# EAGLE design introAu (EAGLE 7.3.0)
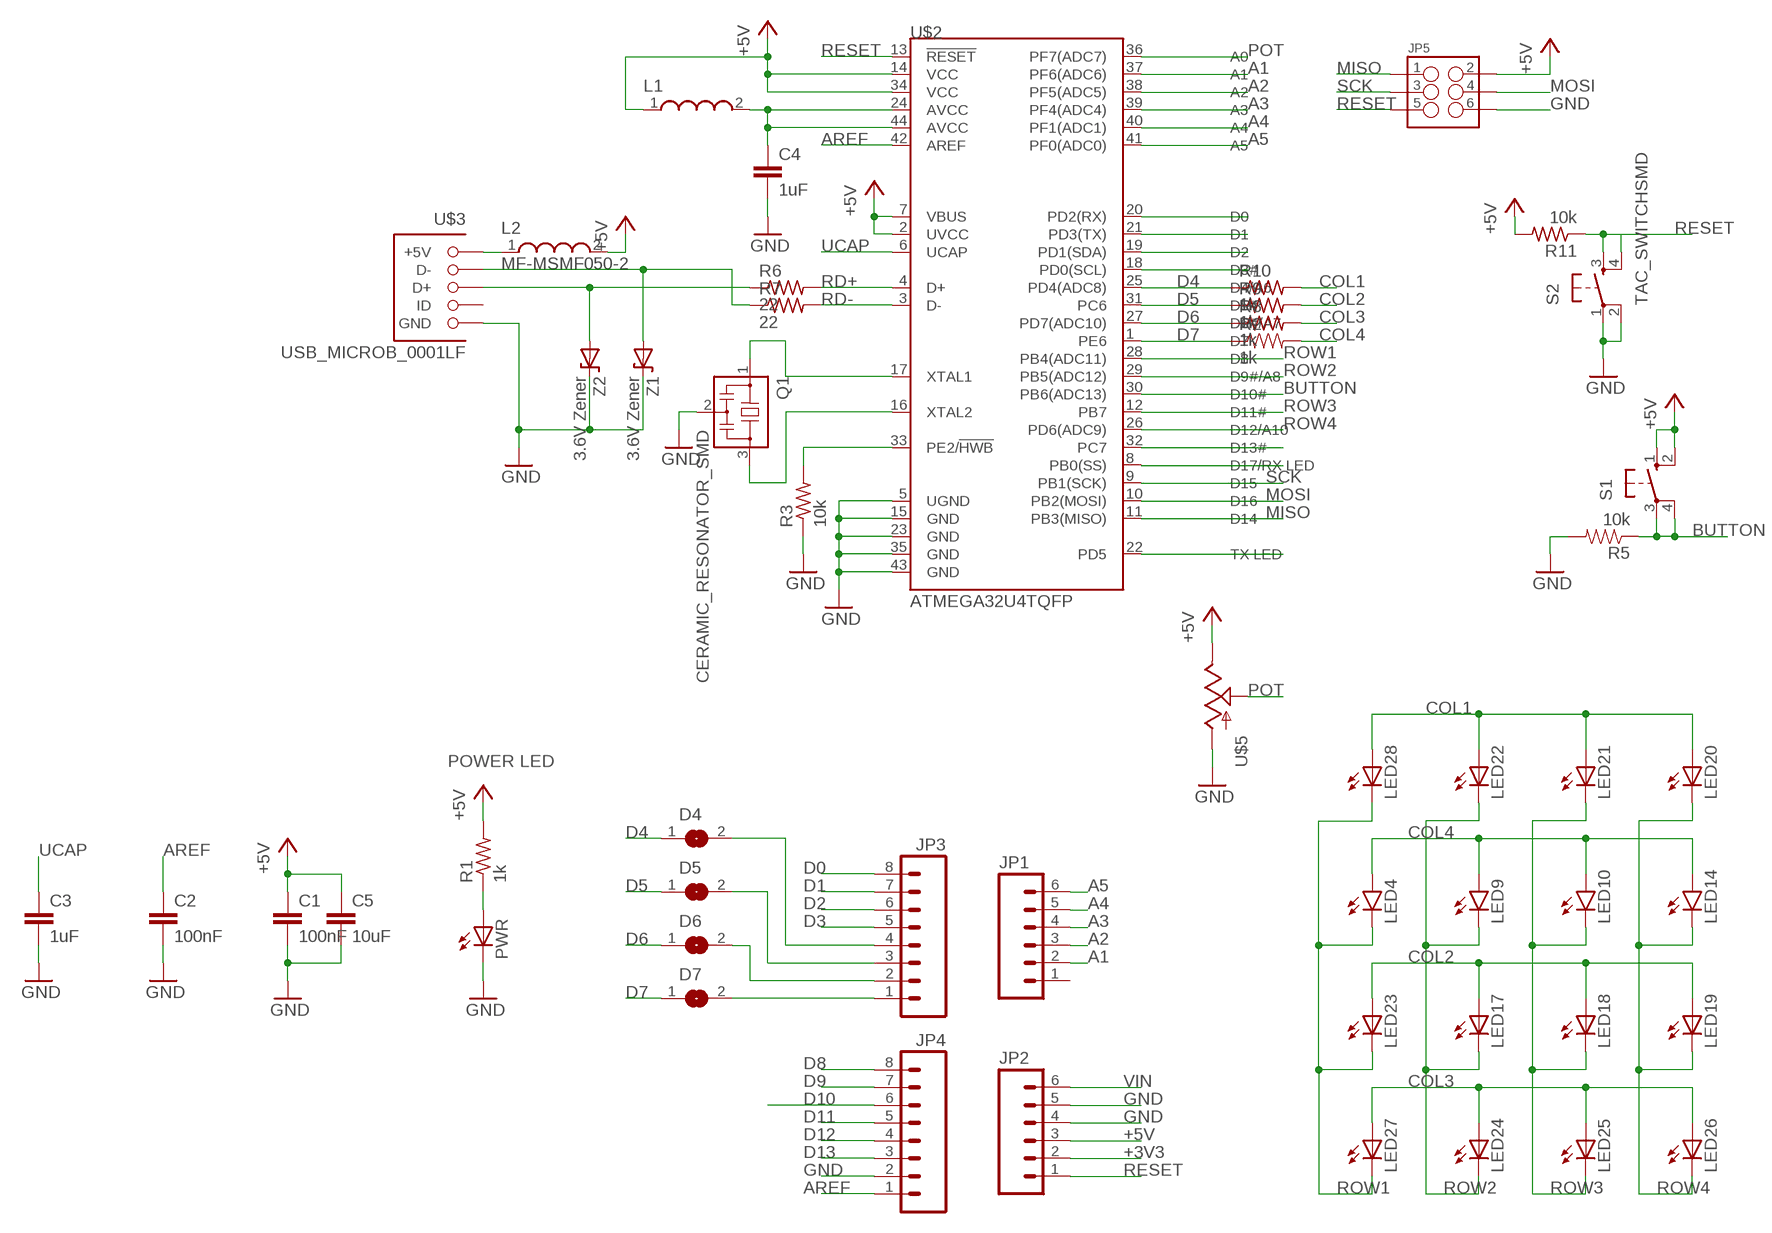
[diagram p0: schematic, sheet 1]

## Parts
C1  100nF  C-EUC0805  [C0805]
C2  100nF  C-EUC0805  [C0805]
C3  1uF  C-EUC0805  [C0805]
C4  1uF  C-EUC0805  [C0805]
C5  10uF  C-EUC0805  [C0805]
D4  SJ  [SJ]
D5  SJ  [SJ]
D6  SJ  [SJ]
D7  SJ  [SJ]
JP1  M06SMD-STRAIGHT-COMBO  [1X06_SMD_STRAIGHT_COMBO]
JP2  M06SMD-STRAIGHT-COMBO  [1X06_SMD_STRAIGHT_COMBO]
JP3  M08SMD-COMBO  [1X08_SMD_COMBINED]
JP4  M08SMD-COMBO  [1X08_SMD_COMBINED]
JP5  M03X22X3_SILK_SM  [2X3]
L1  WE-CBF_0805(WB/HS)  [WE-CBF_0805(W=3.0)]
L2  MF-MSMF050-2  WE-CBF_1812(HC)  [WE-CBF_1812(W=7.3)]
LED4  LED5MM  [LED5MM]
LED9  LED5MM  [LED5MM]
LED10  LED5MM  [LED5MM]
LED14  LED5MM  [LED5MM]
LED17  LEDCHIPLED_0805  [CHIPLED_0805]
LED18  LEDCHIPLED_0805  [CHIPLED_0805]
LED19  LEDCHIPLED_0805  [CHIPLED_0805]
LED20  LEDCHIPLED_0805  [CHIPLED_0805]
LED21  LEDCHIPLED_0805  [CHIPLED_0805]
LED22  LEDCHIPLED_0805  [CHIPLED_0805]
LED23  LEDCHIPLED_0805  [CHIPLED_0805]
LED24  LEDCHIPLED_0805  [CHIPLED_0805]
LED25  LEDCHIPLED_0805  [CHIPLED_0805]
LED26  LEDCHIPLED_0805  [CHIPLED_0805]
LED27  LEDCHIPLED_0805  [CHIPLED_0805]
LED28  LEDCHIPLED_0805  [CHIPLED_0805]
PWR  LEDCHIPLED_0805  [CHIPLED_0805]
Q1  CERAMIC_RESONATOR_SMD  [CERAMIC_RESONATOR_SMD]
R1  1k  R-US_R0805  [R0805]
R2  1k  1KOHM1/4W5%(PTH)HORIZ-KIT  [AXIAL-0.3EZ]
R3  10k  R-US_R0805  [R0805]
R5  10k  1KOHM1/4W5%(PTH)HORIZ-KIT  [AXIAL-0.3EZ]
R6  22  R-US_R0805  [R0805]
R7  22  R-US_R0805  [R0805]
R8  1k  R-US_R0805  [R0805]
R9  1k  R-US_R0805  [R0805]
R10  1k  R-US_R0805  [R0805]
R11  10k  R-US_R0805  [R0805]
S1  TACT_BUTTON  [B3F-10XX]
S2  TAC_SWITCHSMD  [TACTILE-SWITCH-SMD]
U$2  ATMEGA32U4TQFP  [SPARKFUN-DIGITALIC_TQFP44]
U$3  USB_MICROB_0001LF  [USB_MICROB_CHEAPER]
U$5  POT  [ALPS_POT]
Z1  3.6V Zener  DIODE-ZENER-BZT52  [SOD-323]
Z2  3.6V Zener  DIODE-ZENER-BZT52  [SOD-323]

## Nets
+3V3: JP2.2
+5V: C1.1 C5.1 JP2.3 JP5.2 L1.1 L2.2 R1.2 R11.2 S1.1(S) S1.2(S1) U$2.2(UVCC) U$2.7(VBUS) U$2.14(VCC) U$2.34(VCC) U$5.P$1(E)
A1: JP1.2 U$2.37(PF6(ADC6))
A2: JP1.3 U$2.38(PF5(ADC5))
A3: JP1.4 U$2.39(PF4(ADC4))
A4: JP1.5 U$2.40(PF1(ADC1))
A5: JP1.6 U$2.41(PF0(ADC0))
AREF: C2.1 JP4.1 U$2.42(AREF)
BUTTON: R5.P$1 S1.3(P) S1.4(P1) U$2.30(PB6(ADC13))
COL1: LED20.A LED21.A LED22.A LED28.A R10.2
COL2: LED17.A LED18.A LED19.A LED23.A R9.2
COL3: LED24.A LED25.A LED26.A LED27.A R8.2
COL4: LED4.A LED9.A LED10.A LED14.A R2.P$2
D0: JP3.8 U$2.20(PD2(RX))
D1: JP3.7 U$2.21(PD3(TX))
D2: JP3.6 U$2.19(PD1(SDA))
D3: JP3.5 U$2.18(PD0(SCL))
D4: D4.1 R10.1 U$2.25(PD4(ADC8))
D5: D5.1 R9.1 U$2.31(PC6)
D6: D6.1 R8.1 U$2.27(PD7(ADC10))
D7: D7.1 R2.P$1 U$2.1(PE6)
D8: JP4.8
D9: JP4.7
D10: JP4.6
D11: JP4.5
D12: JP4.4
D13: JP4.3 U$2.32(PC7)
D17: U$2.8(PB0(SS))
GND: C1.2 C2.2 C3.2 C4.2 C5.2 JP2.4 JP2.5 JP4.2 JP5.6 PWR.C Q1.2 R3.1 R5.P$2 S2.2 U$2.5(UGND) U$2.15(GND) U$2.23(GND) U$2.35(GND) U$2.43(GND) U$3.P$5(GND) U$5.P$3(A) Z1.1(C) Z2.1(C)
MISO: JP5.1 U$2.11(PB3(MISO))
MOSI: JP5.4 U$2.10(PB2(MOSI))
N$1: L2.1 U$3.P$1(+5V)
N$5: Q1.3 U$2.16(XTAL2)
N$6: Q1.1 U$2.17(XTAL1)
N$7: R7.1 U$3.P$2(D-) Z1.2(A)
N$8: R3.2 U$2.33(PE2/!HWB)
N$9: R6.1 U$3.P$3(D+) Z2.2(A)
N$10: C4.1 L1.2 U$2.24(AVCC) U$2.44(AVCC)
N$11: PWR.A R1.1
N$12: D7.2 JP3.1
N$15: D5.2 JP3.3
N$16: D6.2 JP3.2
N$17: D4.2 JP3.4
POT: U$2.36(PF7(ADC7)) U$5.P$2(S)
RD+: R6.2 U$2.4(D+)
RD-: R7.2 U$2.3(D-)
RESET: JP2.1 JP5.5 R11.1 S2.3 S2.4 U$2.13(!RESET)
ROW1: LED4.K(C) LED23.C LED27.C LED28.C U$2.28(PB4(ADC11))
ROW2: LED9.K(C) LED17.C LED22.C LED24.C U$2.29(PB5(ADC12))
ROW3: LED10.K(C) LED18.C LED21.C LED25.C U$2.12(PB7)
ROW4: LED14.K(C) LED19.C LED20.C LED26.C U$2.26(PD6(ADC9))
SCK: JP5.3 U$2.9(PB1(SCK))
TX: U$2.22(PD5)
UCAP: C3.1 U$2.6(UCAP)
VIN: JP2.6
Unconnected: JP1.1 S2.1 U$3.P$4(ID)

## Notes on the sheet
- POWER LED

## Library data of the parts
C1-C5 = rcl:C-EU: CAPACITOR, European symbol
D4-D7 = jumper:SJ: SMD solder JUMPER
JP1 JP2 = SparkFun-Connectors:M06: Header 6 Standard 6-pin 0.1" header. Use with straight break away headers (SKU : PRT-00116), right angle break away headers (PRT-00553), swiss pins (PRT-00743), machine pins (PRT-00117), and female headers (PRT-00115). Molex polarized connector foot print use with SKU : PRT-08094 with associated crimp pins and housings. NOTES ON THE VARIANTS LOCK and LOCK_LONGPADS... This footprint was designed to help hold the alignment of a through-hole component (i.e. 6-pin header) while soldering it into place. You may notice that each hole has been shifted either up or down by 0.005 of an inch from it's more standard position (which is a perfectly straight line). This slight alteration caused the pins (the squares in the middle) to touch the edges of the holes. Because they are alternating, it causes a "brace" to hold the component in place. 0.005 has proven to be the perfect amount of "off-center" position when using our standard breakaway headers. Although looks a little odd when you look at the bare footprint, once you have a header in there, the alteration is very hard to notice. Also,if you push a header all the way into place, it is covered up entirely on the bottom side. This idea of altering the position of holes to aid alignment will be further integrated into the Sparkfun Library for other footprints. It can help hold any component with 3 or more connection pins.
JP3 JP4 = SparkFun-Connectors:M08: Header 8 Standard 8-pin 0.1" header. Use with straight break away headers (SKU : PRT-00116), right angle break away headers (PRT-00553), swiss pins (PRT-00743), machine pins (PRT-00117), and female headers (PRT-00115).
JP5 = SparkFun-Connectors:M03X2: 2x3 .1" header. Shrouded, with keying- CONN-10681 SMT- CONN-11415 Pogo pins- HW-11044
L1 L2 = EagleLibrary_Wuerth_Elektronik_eiSos_rev15c:WE-CBF: WE-CBF SMD EMI Suppression Ferrite Bead Characteristics Reliable Ni-Sn electrodes High rated current up to 6 A Operating temperature: –55 ºC to +125 ºC Applications Perfect as data lined filter and for uncoupling of distribution voltage Variant abbreviation WB means WIDE BAND HS means HIGH SPEED HC means HIGH CURRENT <http://katalog.we-online.de/media/images/eisos/FeCBF_pf2.jpg> Details see: http://katalog.we-online.de/en/pbs/WE-CBF Updated on 2014-06-19 2014 (C) Wurth Elektronik
LED4 LED9 LED10 LED14 = SparkFun-LED:LED: LEDs Standard schematic elements and footprints for 5mm, 3mm, 1206, and 0603 sized LEDs. 5mm - Spark Fun Electronics SKU : COM-00529 (and others)
LED17-LED28 PWR = led:LED: LED OSRAM: - CHIPLED LG R971, LG N971, LY N971, LG Q971, LY Q971, LO R971, LY R971 LH N974, LH R974 LS Q976, LO Q976, LY Q976 LO Q996 - Hyper CHIPLED LW Q18S LB Q993, LB Q99A, LB R99A - SideLED LS A670, LO A670, LY A670, LG A670, LP A670 LB A673, LV A673, LT A673, LW A673 LH A674 LY A675 LS A676, LA A676, LO A676, LY A676, LW A676 LS A679, LY A679, LG A679 - Hyper Micro SIDELED® LS Y876, LA Y876, LO Y876, LY Y876 LT Y87S - SmartLED LW L88C, LW L88S LB L89C, LB L89S, LG L890 LS L89K, LO L89K, LY L89K LS L896, LA L896, LO L896, LY L896 - TOPLED LS T670, LO T670, LY T670, LG T670, LP T670 LSG T670, LSP T670, LSY T670, LOP T670, LYG T670 LG T671, LOG T671, LSG T671 LB T673, LV T673, LT T673, LW T673 LH T674 LS T676, LA T676, LO T676, LY T676, LB T676, LH T676, LSB T676, LW T676 LB T67C, LV T67C, LT T67C, LS T67K, LO T67K, LY T67K, LW E67C LS E67B, LA E67B, LO E67B, LY E67B, LB E67C, LV E67C, LT E67C LW T67C LS T679, LY T679, LG T679 LS T770, LO T770, LY T770, LG T770, LP T770 LB T773, LV T773, LT T773, LW T773 LH T774 LS E675, LA E675, LY E675, LS T675 LS T776, LA T776, LO T776, LY T776, LB T776 LHGB T686 LT T68C, LB T68C - Hyper Mini TOPLED® LB M676 - Mini TOPLED Santana® LG M470 LS M47K, LO M47K, LY M47K Source: http://www.osram.convergy.de LUXEON: - LUMILED® LXK2-PW12-R00, LXK2-PW12-S00, LXK2-PW14-U00, LXK2-PW14-V00 LXK2-PM12-R00, LXK2-PM12-S00, LXK2-PM14-U00 LXK2-PE12-Q00, LXK2-PE12-R00, LXK2-PE12-S00, LXK2-PE14-T00, LXK2-PE14-U00 LXK2-PB12-K00, LXK2-PB12-L00, LXK2-PB12-M00, LXK2-PB14-N00, LXK2-PB14-P00, LXK2-PB14-Q00 LXK2-PR12-L00, LXK2-PR12-M00, LXK2-PR14-Q00, LXK2-PR14-R00 LXK2-PD12-Q00, LXK2-PD12-R00, LXK2-PD12-S00 LXK2-PH12-R00, LXK2-PH12-S00 LXK2-PL12-P00, LXK2-PL12-Q00, LXK2-PL12-R00 Source: www.luxeon.com KINGBRIGHT: KA-3528ASYC Source: www.kingbright.com
Q1 = MESH_Arduino:CERAMIC_RESONATOR_SMD: Resonator
R1 R3 R6-R11 = rcl:R-US_: RESISTOR, American symbol
R2 = SparkFun-Resistors:1KOHM1/4W5%(PTH): RES-08380; PROD_ID: RES-08380
R5 = SparkFun-Resistors:1KOHM1/4W5%(PTH): RES-08380; PROD_ID: RES-08380; VALUE: 1k
S1 = MESH_Arduino:TACT_BUTTON: OMRON SWITCH; MPN: B3F-1000; OC_FARNELL: 176432; OC_NEWARK: 36M3542
S2 = mBLE:TAC_SWITCH: Momentary Switch Button commonly used for reset or general input. Spark Fun Electronics SKU : COM-00097 SMT- SWCH-08247; PROD_ID: SWCH-08247
U$2 = SparkFun-DigitalIC:ATMEGA32U4: Atmel 44-pin 8-bit Microcontroller with 32KBytes of ISP Flash and USB Controller ----- Please use the QFN-44-NOPAD_1:1 package for the footprint of all boards using a 32U4. Route traces directly away from the pads as much as possible.
U$3 = mBLE:USB_MICROB_0001LF
U$5 = SparkFun-Electromechanical:POT
Z1 Z2 = SparkFun-DiscreteSemi:DIODE-ZENER: Zener Diode Production Part - 8199 3.4V Zener Voltage

## Board
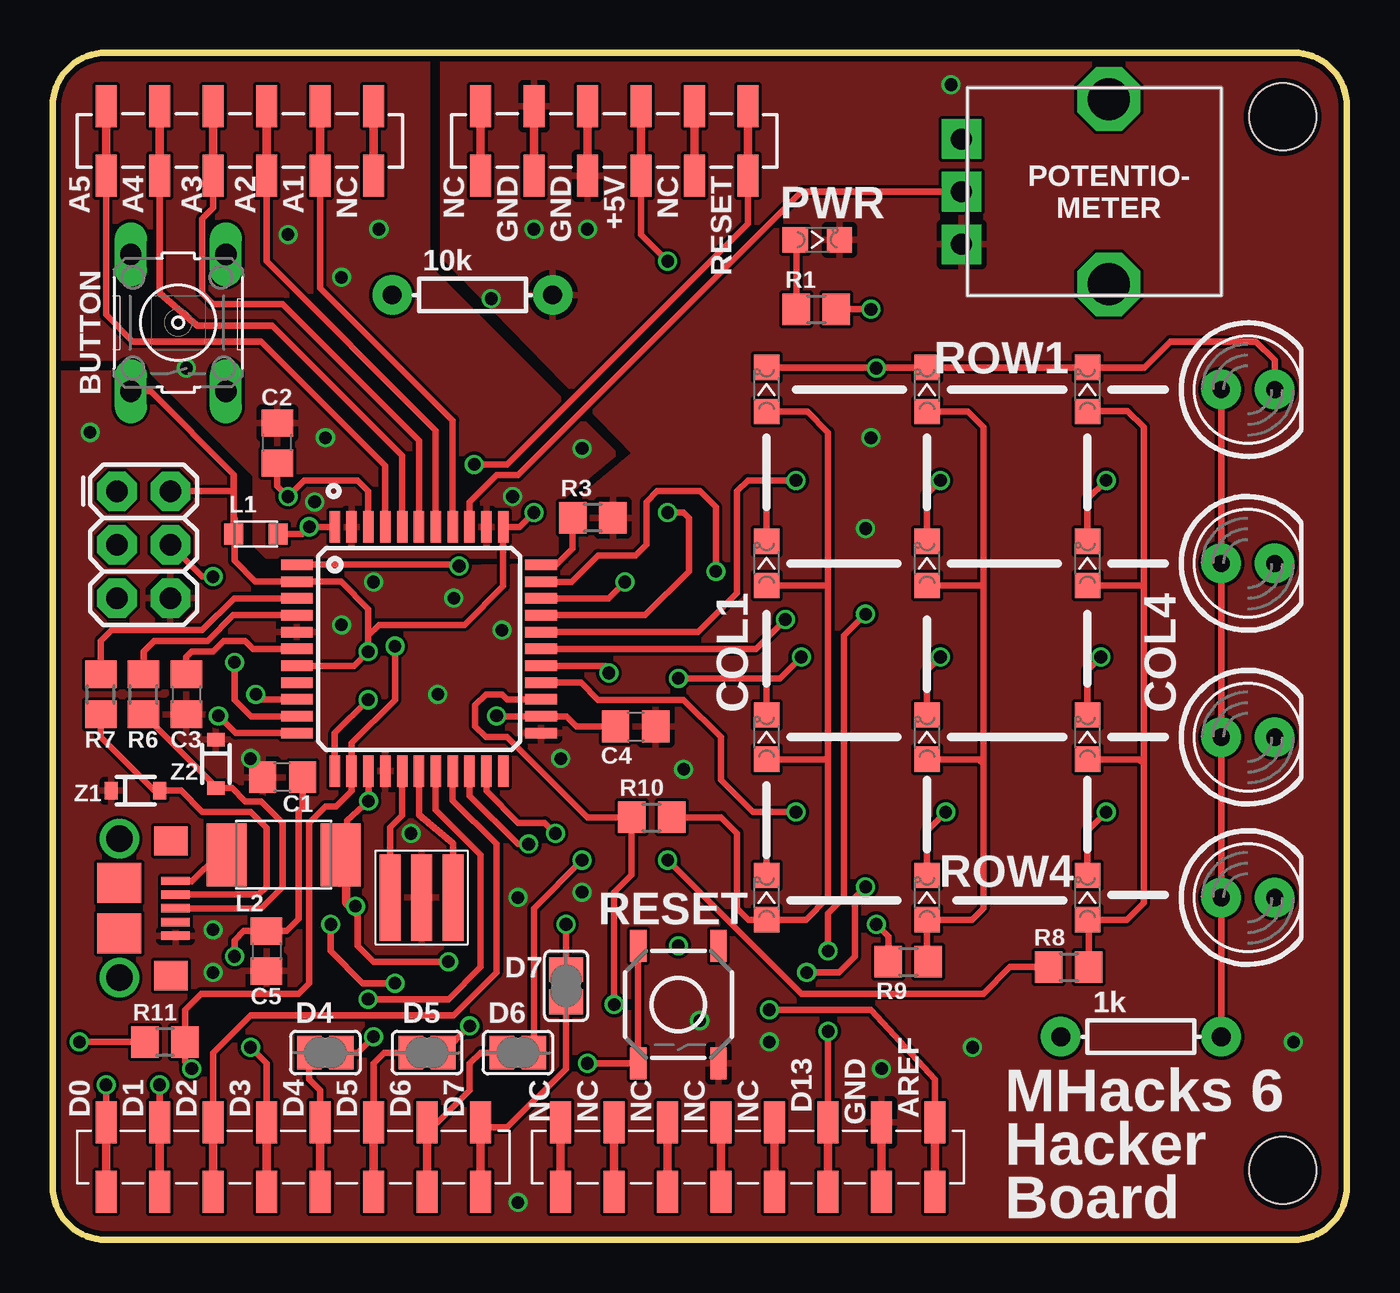
[diagram p1: board, top side]
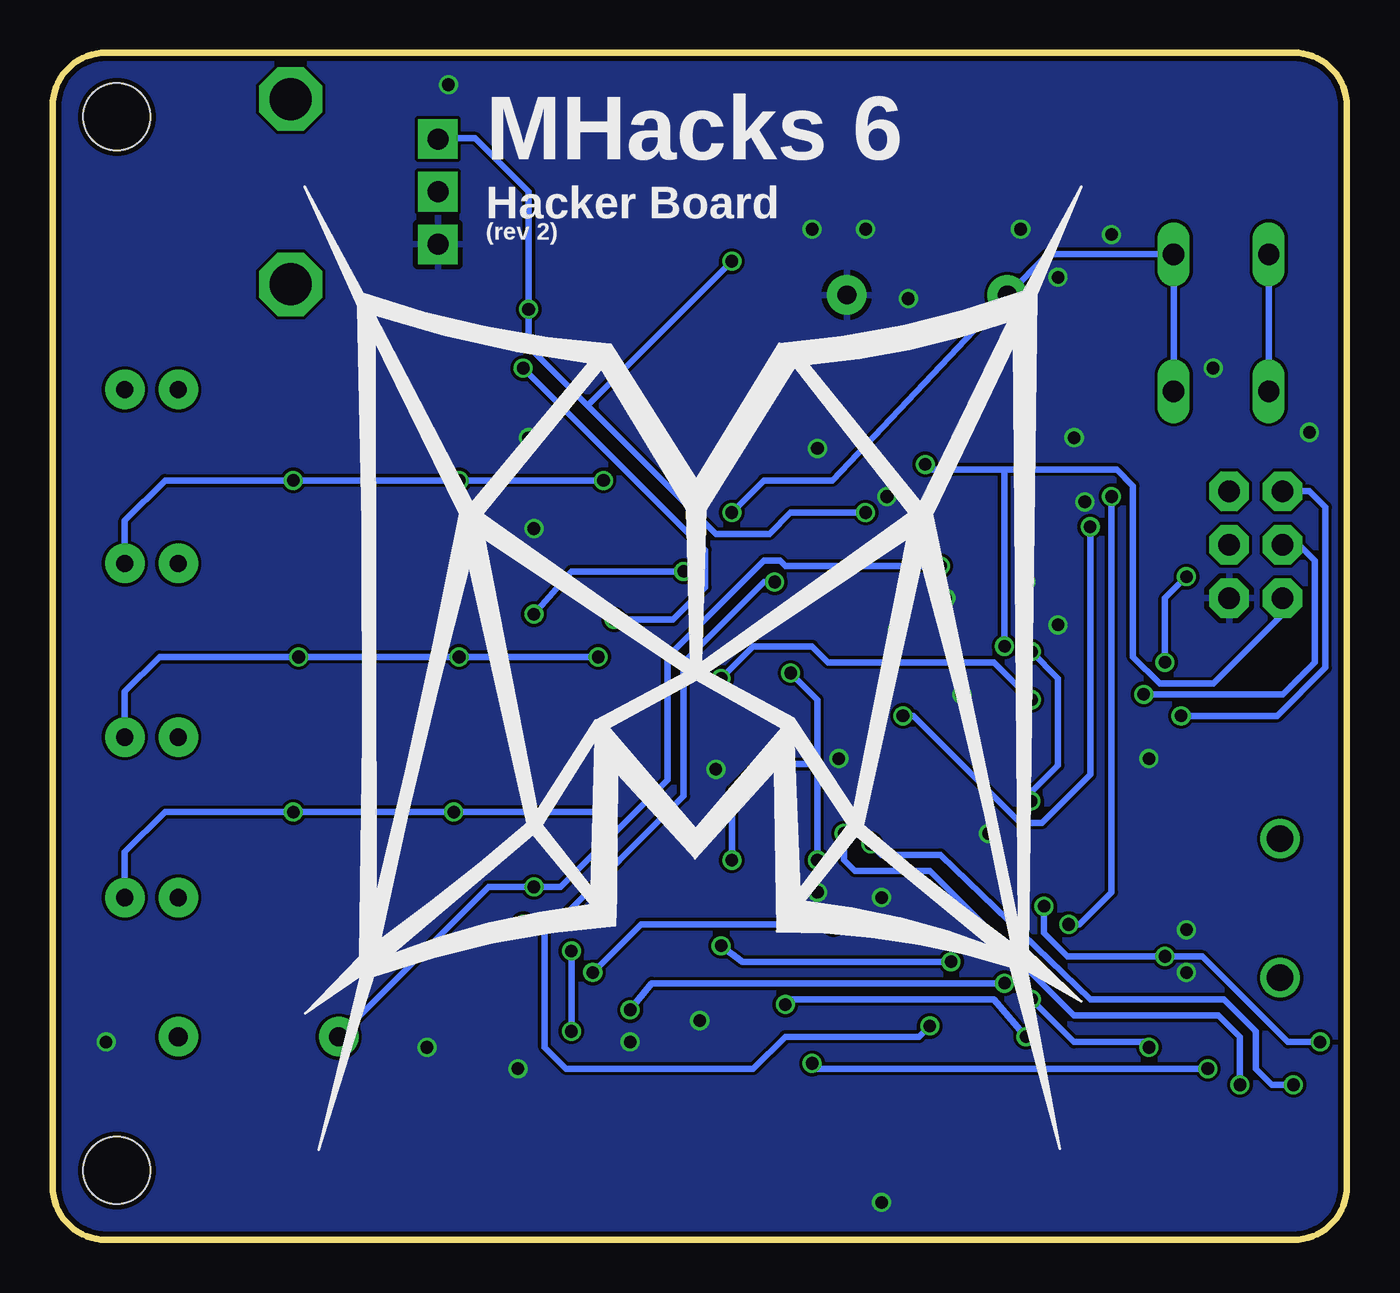
[diagram p2: board, bottom side, seen from below]

Size 61.47 x 56.39 mm. Coordinates in mm from the lower left corner, seen from the top.
Outline: 2.54,56.39 58.93,56.39 arc-90 61.47,53.85 61.47,2.54 arc-90 58.93,0 2.54,0 arc-90 0,2.54 0,53.85 arc-90 2.54,56.39
Copper layers (1*16): Top 0.035mm / dielectric 1.5mm / Bottom 0.035mm
Design rules "SeeedStudio_2layer_DRU_no_angle_20140221": minimum track width 6mil, minimum drill 12mil, track to track 6mil, track to pad 6mil, pad to pad 6mil, via to via 6mil, smd to smd 0mil, copper to edge 10mil, drill to drill 10mil, minimum pad ring 10mil, minimum via ring 6mil, stop-mask expansion 2mil, vias tented up to drill 100mil, thermal gap 10mil
Holes 3.17 mm at 58.42,3.3 58.42,53.34

### Footprints (pad centres in the part's own frame; a part is rotated, then mirrored left to right if it is on the bottom)
C0805 = smd 1.3 x 1.5: 1 -0.95,0; 2 0.95,0
SJ = smd 1.168 x 1.6: 1 -0.762,0; 2 0.762,0
1X06_SMD_STRAIGHT_COMBO = smd 1 x 2: 1 0,-1.65; 1-2 0,1.65; 2 2.54,1.65; 2-2 2.54,-1.65; 3 5.08,-1.65; 3-2 5.08,1.65; 4 7.62,1.65; 4-2 7.62,-1.65; 5 10.16,-1.65; 5-2 10.16,1.65; 6 12.7,1.65; 6-2 12.7,-1.65
1X08_SMD_COMBINED = smd 1 x 2: 1 0,1.65; 1@2 0,-1.65; 2 2.54,-1.65; 2@2 2.54,1.65; 3 5.08,1.65; 3@2 5.08,-1.65; 4 7.62,-1.65; 4@2 7.62,1.65; 5 10.16,1.65; 5@2 10.16,-1.65; 6 12.7,-1.65; 6@2 12.7,1.65; 7 15.24,1.65; 7@2 15.24,-1.65; 8 17.78,-1.65; 8@2 17.78,1.65
2X3 = drill 1.016 pad 1.88 octagon: 1 0,0; 2 0,2.54; 3 2.54,0; 4 2.54,2.54; 5 5.08,0; 6 5.08,2.54
WE-CBF_0805(W=3.0) = smd 0.9 x 1: 1 -1.05,0; 2 1.05,0
WE-CBF_1812(W=7.3) = smd 1.9 x 3: 1 -2.7,0; 2 2.7,0
LED5MM = drill 0.813 pad 1.88: A -1.27,0; K 1.27,0
CHIPLED_0805 = smd 1.2 x 1.2: A 0,-1.05; C 0,1.05
CERAMIC_RESONATOR_SMD = smd 1 x 4.1: 1 -1.5,0; 2 0,0; 3 1.5,0
R0805 = smd 1.3 x 1.5: 1 -0.95,0; 2 0.95,0
AXIAL-0.3EZ = drill 0.9 pad 1.88: P$1 -3.81,0; P$2 3.81,0
B3F-10XX = drill 1.016 long: 1 -3.251,2.261; 2 3.251,2.261; 3 -3.251,-2.261; 4 3.251,-2.261
TACTILE-SWITCH-SMD = smd 1.524 x 0.762: 1 -2.794,1.905; 2 2.794,1.905; 3 -2.794,-1.905; 4 2.794,-1.905
SPARKFUN-DIGITALIC_TQFP44 = smd 1.5 x 0.5: 1 -5.8,4; 2 -5.8,3.2; 3 -5.8,2.4; 4 -5.8,1.6; 5 -5.8,0.8; 6 -5.8,0; 7 -5.8,-0.8; 8 -5.8,-1.6; 9 -5.8,-2.4; 10 -5.8,-3.2; 11 -5.8,-4; 23 5.8,-4; 24 5.8,-3.2; 25 5.8,-2.4; 26 5.8,-1.6; 27 5.8,-0.8; 28 5.8,0; 29 5.8,0.8; 30 5.8,1.6; 31 5.8,2.4; 32 5.8,3.2; 33 5.8,4 | smd 0.5 x 1.5: 12 -4,-5.8; 13 -3.2,-5.8; 14 -2.4,-5.8; 15 -1.6,-5.8; 16 -0.8,-5.8; 17 0,-5.8; 18 0.8,-5.8; 19 1.6,-5.8; 20 2.4,-5.8; 21 3.2,-5.8; 22 4,-5.8; 34 4,5.8; 35 3.2,5.8; 36 2.4,5.8; 37 1.6,5.8; 38 0.8,5.8; 39 0,5.8; 40 -0.8,5.8; 41 -1.6,5.8; 42 -2.4,5.8; 43 -3.2,5.8; 44 -4,5.8
USB_MICROB_CHEAPER = smd 0.4 x 1.35: P$1 -1.3,0; P$2 -0.65,0; P$3 0,0; P$4 0.65,0; P$5 1.3,0 | smd 1.4 x 1.6: P$6 -3.2,-0.225; P$7 3.2,-0.225 | drill 1.25: P$8 -3.3,-2.675; P$9 3.3,-2.675 | smd 1.9 x 2.1: P$10 -1.2,-2.675; P$12 1.2,-2.675
ALPS_POT = drill 1 pad 1.88 square: P$1 7,-2.5; P$2 7,0; P$3 7,2.5 | drill 2 octagon: P$4 0,-4.4; P$5 0,4.4
SOD-323 = smd 0.63 x 0.83: 1 -1.15,0; 2 1.15,0

### Placement (x,y rotation side)
C1  10.92,21.97 180 top
C2  10.67,37.85 90 top
C3  6.35,25.91 270 top
C4  27.69,24.38 0 top
C5  10.16,13.72 270 top
D4  12.95,8.89 180 top
D5  17.78,8.89 180 top
D6  22.1,8.89 180 top
D7  24.38,12.06 270 top
JP1  15.24,52.2 180 top
JP2  33.02,52.2 180 top
JP3  20.32,3.94 180 top
JP4  41.91,3.94 180 top
JP5  3.05,35.56 270 top
L1  9.65,33.53 0 top
L2  10.97,18.29 0 top
LED4  56.77,40.39 0 top
LED9  56.77,32.13 0 top
LED10  56.77,23.88 0 top
LED14  56.77,16.26 0 top
LED17  41.53,32.13 0 top
LED18  41.53,23.88 0 top
LED19  41.53,16.26 0 top
LED20  33.91,16.26 0 top
LED21  33.91,23.88 0 top
LED22  33.91,32.13 0 top
LED23  41.53,40.39 0 top
LED24  49.15,32.13 0 top
LED25  49.15,23.88 0 top
LED26  49.15,16.26 0 top
LED27  49.15,40.39 0 top
LED28  33.91,40.39 0 top
PWR  36.32,47.5 270 top
Q1  17.53,16.26 180 top
R1  36.27,44.2 0 top
R2  51.69,9.65 0 top
R3  25.65,34.29 180 top
R5  19.94,44.88 0 top
R6  4.32,25.91 90 top
R7  2.29,25.91 90 top
R8  48.26,12.95 0 top
R9  40.64,13.21 0 top
R10  28.45,20.07 0 top
R11  5.33,9.4 180 top
S1  5.97,43.56 90 top
S2  29.72,11.18 270 top
U$1  [MHACKS6-BIG]  49.53,4.32 0 bottom
U$2  17.4,28.07 0 top
U$3  5.84,15.75 270 top
U$5  50.16,49.78 180 top
Z1  3.94,21.34 0 top
Z2  7.75,22.61 270 top

### Tracks (layer width: path | path; a pad name or v marks a point on that pad's centre or on a via)
+5V  (via drill 0.6)
  Top 0.305: U$2.7 14.31,27.27 v14.99,27.94 14.99,28.7 | U$2.14 v15,20.84 13.98,19.92 13.94,18.8 L2.2 13.62,16.92 | R1.2 v38.86,44.2 | 14.99,28.7 14.99,29.97 13.69,31.27 U$2.2 9.63,31.27 8.64,32.26 8.64,34.26 L1.1 8.6,35.56 | v22.86,34.54 22.18,33.87 U$2.34 21.4,31.05 19.56,29.21 15.49,29.21 14.99,28.7 | 8.6,35.56 8.6,36.36 4.65,40.31 S1.1 | JP5.2 8.6,35.56 | JP2.3 27.94,47.75 v29.21,46.48 | R11.2 v1.27,9.4 | v8.64,13.46 8.64,14.22 9.08,14.67 C5.1 11.11,14.67 11.68,15.24 11.68,20.32 11.87,20.51 C1.1 | v18.8,13.21 15.24,13.21 14.48,13.97 14.48,15.75
  Top 0.406: L2.2 13.75,18.67 | 13.94,18.8 13.94,16.03 14.13,15.84 v14.38,15.84 14.48,15.75
  Bottom 0.305: S1.1 S1.2 | v15,20.84 15,21.25 13.72,22.53 13.72,26.67 v14.99,27.94 | v22.86,34.54 26.42,34.54 27.43,33.53 29.97,33.53 36.07,39.62 | v18.8,13.21 28.7,13.21 v29.72,13.97 | 36.07,39.62 38.86,42.42 v38.86,44.2 38.86,49.78 41.4,52.32 43.12,52.32 U$5.P$1 | v29.21,46.48 36.07,39.62 | v1.27,9.4 2.79,9.4 6.86,13.46 v8.64,13.46 13.27,13.46 14.38,14.57 v14.38,15.84
A1
  Top 0.305: U$2.37 19,38.91 12.7,45.21 JP1.2
A2
  Top 0.305: U$2.38 18.2,38.44 10.16,46.48 JP1.3
A3
  Top 0.305: U$2.39 17.4,37.97 10.92,44.45 7.62,44.45 7.11,44.96 7.11,48.51 7.62,49.02 JP1.4
A4
  Top 0.305: JP1.5 5.08,44.96 6.86,43.43 10.41,43.43 16.6,37.25 U$2.40
A5
  Top 0.305: U$2.41 15.8,36.78 9.91,42.67 3.81,42.67 2.54,43.94 JP1.6
AREF  (via drill 0.6)
  Top 0.305: JP4.1 41.91,7.62 38.86,10.92 v34.04,10.92 | U$2.42 14.99,33.88 14.99,35.56 14.48,36.07 11.94,36.07 v11.18,35.31 10.67,35.81 C2.1 | v16.26,12.19 14.73,12.19 13.21,13.72 v13.21,14.99
  Bottom 0.305: v34.04,10.92 33.02,12.19 v16.26,12.19 | v11.18,35.31 11.18,16.51 12.7,14.99 v13.21,14.99
BUTTON  (via drill 0.6)
  Top 0.305: U$2.30 28.14,29.67 30.23,31.75 30.23,34.29 29.97,34.54 v29.21,34.54
  Bottom 0.305: S1.3 S1.4 14.2,46.81 R5.P$1 24.43,36.07 27.69,36.07 v29.21,34.54
COL1
  Top 0.305: LED28.A 35.85,39.34 36.83,38.35 36.83,30.99 | 36.83,30.99 36.83,22.86 | 36.83,22.86 36.83,16.26 35.78,15.21 LED20.A 33.05,15.21 32.51,15.75 32.51,19.3 31.75,20.07 R10.2 | LED21.A 36.8,22.83 36.83,22.86 | LED22.A 36.74,31.08 36.83,30.99
COL2
  Top 0.305: LED23.A 43.47,39.34 44.2,38.61 44.2,30.99 | 44.2,30.99 44.2,22.61 | 44.2,22.61 44.2,15.75 43.65,15.21 LED19.A 41.53,13.27 R9.2 | LED18.A 43.98,22.83 44.2,22.61 | LED17.A 44.1,31.08 44.2,30.99
COL3
  Top 0.305: R8.2 49.21,15.01 LED26.A 51.02,15.21 51.82,16 51.82,22.61 | 51.82,22.61 51.82,30.99 | 51.82,30.99 51.82,38.61 51.05,39.37 49.18,39.37 LED27.A | LED25.A 51.6,22.83 51.82,22.61 | LED24.A 51.72,31.08 51.82,30.99
COL4
  Top 0.305: R2.P$2 LED14.A LED10.A LED9.A LED4.A
D0  (via drill 0.6)
  Top 0.305: U$2.20 19.8,21.09 22.1,18.8 v22.61,18.8 | v2.54,7.37 JP3.8
  Bottom 0.305: v22.61,18.8 22.1,18.29 19.3,18.29 12.19,11.43 5.84,11.43 4.32,9.91 4.32,8.13 3.56,7.37 v2.54,7.37
D1  (via drill 0.6)
  Top 0.305: U$2.21 20.6,21.31 22.1,19.81 23.37,19.81 v23.88,19.3 | v5.08,7.37 JP3.7
  Bottom 0.305: v5.08,7.37 5.08,9.65 6.1,10.67 12.95,10.67 19.81,17.53 23.37,17.53 23.88,18.03 v23.88,19.3
D2
  Top 0.305: U$2.19 19,20.88 21.08,18.8 21.08,12.7 19.05,10.67 9.4,10.67 7.62,8.89 JP3.6
D3  (via drill 0.6)
  Top 0.305: U$2.18 18.2,20.41 20.32,18.29 20.32,12.95 18.8,11.43 v14.99,11.43 | v9.4,9.14 10.16,8.38 JP3.5
  Bottom 0.305: v9.4,9.14 9.65,9.4 12.95,9.4 v14.99,11.43
D4  (via drill 0.6)
  Top 0.305: R10.1 25.4,20.07 21.59,23.88 20.57,23.88 20.07,24.38 20.07,25.4 20.57,25.91 21.34,25.91 21.58,25.67 U$2.25 | v26.67,11.18 26.67,16.51 27.5,17.34 R10.1 | 27.43,20.13 R10.1 | D4.1 14.48,8.89 v15.24,9.65
  Bottom 0.305: v15.24,9.65 16.76,11.43 26.42,11.43 v26.67,11.18
D5  (via drill 0.6)
  Top 0.305: U$2.31 26.4,30.47 v27.18,31.24 | v39.12,14.99 39.69,14.41 R9.1 | D5.1 v19.81,10.16
  Bottom 0.305: v39.12,14.99 38.1,14.99 | v27.18,31.24 27.69,31.24 31.5,27.43 31.5,21.08 37.59,14.99 38.1,14.99 | 38.1,14.99 38.1,9.14 37.08,8.13 28.19,8.13 26.67,9.65 20.32,9.65 v19.81,10.16
D6  (via drill 0.6)
  Top 0.305: v26.42,26.92 26.25,27.27 U$2.27 | R8.1 45.47,12.95 44.2,11.68 35.56,11.68 v29.21,18.03 | D6.1 22.86,15.75 v25.15,18.03
  Bottom 0.305: v25.15,18.03 25.15,22.35 | 25.15,22.35 25.15,25.65 v26.42,26.92 | v29.21,18.03 29.21,21.34 27.94,22.61 25.4,22.61 25.15,22.35
D7  (via drill 0.6)
  Top 0.305: U$2.1 19.24,32.07 v19.3,32 | v35.81,12.7 37.34,12.7 38.1,13.46 38.1,16.26 v38.61,16.76 | D7.1 v24.38,14.99
  Bottom 0.305: v19.3,32 26.67,32 26.92,32.26 27.69,32.26 32.26,27.69 32.26,21.84 37.34,16.76 v38.61,16.76 40.77,16.76 R2.P$1 | v35.81,12.7 33.53,14.99 v24.38,14.99
D13  (via drill 0.6)
  Top 0.305: v36.83,9.91 JP4.3 | U$2.32 23.22,31.24 24.64,31.24 25.91,32.51 27.69,32.51 28.19,33.02 28.19,35.05 28.7,35.56 30.73,35.56 31.5,34.8 v31.5,31.75 | v36.83,13.72 36.83,15.49 37.59,16.26 37.59,28.7 v38.61,29.72
  Bottom 0.305: v31.5,31.75 36.83,31.75 v38.61,29.72 | v36.83,13.72 v36.83,9.91
GND  (via drill 0.6)
  other vias: 19.05,30.48 7.62,12.7 34.04,9.4 42.67,54.86 20.83,44.7 29.97,22.35 9.4,22.86 24.13,22.86 15.24,31.24 18.29,25.91 21.34,28.96 1.78,38.35 58.93,9.4 43.69,9.14 17.02,19.3 22.86,48.01 25.4,48.01 39.37,8.13 13.72,29.21 12.45,35.05 21.84,35.31 25.15,37.59 38.86,38.1 38.61,33.78 15.49,48.01 11.18,47.75 13.72,45.72 12.95,38.1 6.35,41.4 7.62,14.73 22.1,16.26 25.15,16.51 22.1,1.78 30.73,10.41
  pour Bottom: -0.76,-1.02 -0.76,57.66 62.74,57.66 62.74,-1.27
  pour Top: -1.27,57.66 17.78,57.66 17.78,46.23 26.67,37.34 23.88,35.05 23.88,32.51 10.16,32.51 9.65,33.02 9.65,36.32 4.06,41.91 -1.27,41.91
  pour Top: -1.27,41.15 3.81,41.15 8.89,36.07 8.89,31.75 24.64,32 24.64,34.8 27.69,37.34 18.54,46.74 18.54,57.66 62.74,57.66 62.74,-1.02 -1.27,-1.02
MISO  (via drill 0.6)
  Top 0.305: U$2.11 8.7,24.07 v7.87,24.89
  Bottom 0.305: JP5.1 1.78,35.56 1.02,34.8 1.02,27.18 3.3,24.89 v7.87,24.89
MOSI  (via drill 0.6)
  Top 0.305: U$2.10 9.42,24.87 8.64,25.65 v8.64,27.43 | v7.62,31.5 7.11,31.5 JP5.4
  Bottom 0.305: v8.64,27.43 8.64,30.48 v7.62,31.5
N$1
  Top 0.305: U$3.P$1 6.57,17.05 6.6,17.02 7.87,18.29 L2.1
N$5
  Top 0.305: Q1.3 16.03,19.58 16.6,20.16 U$2.16
N$6
  Top 0.305: Q1.1 19.03,18.82 17.4,20.19 U$2.17
N$7
  Top 0.305: R7.1 2.29,23.88 4.83,21.34 Z1.2 6.1,21.34 7.11,20.32 9.4,20.32 10.16,19.56 10.16,16.76 9.79,16.4 U$3.P$2
N$8
  Top 0.305: U$2.33 23.94,32.07 24.7,32.83 R3.2
N$9
  Top 0.305: U$3.P$3 9.91,15.75 10.92,16.76 10.92,19.81 9.91,20.83 9.14,20.83 8.52,21.46 Z2.2 7.75,21.53 R6.1
N$10  (via drill 0.6)
  Top 0.305: C4.1 24.89,24.38 24.41,24.87 U$2.24 21.11,24.87 v21.08,24.89 | U$2.44 v12.19,33.87 11.85,33.53 L1.2
  Bottom 0.305: v12.19,33.87 12.19,22.1 14.48,19.81 15.49,19.81 20.57,24.89 v21.08,24.89
N$11
  Top 0.305: 35.32,43.74 R1.1 35.32,47.19 PWR.A
N$12
  Top 0.305: JP3.1 20.32,5.33 21.59,5.33 24.38,8.13 D7.2
N$15
  Top 0.305: JP3.3 15.24,8.38 15.75,8.89 D5.2
N$16
  Top 0.305: JP3.2 18.29,5.59 19.81,7.11 19.81,8.38 20.32,8.89 D6.2
N$17
  Top 0.305: JP3.4 12.7,7.11 12.19,7.62 D4.2
POT
  Top 0.305: U$5.P$2 35.56,49.78 22.1,36.32 21.08,36.32 19.81,35.05 19.81,33.88 U$2.36
RD+
  Top 0.305: U$2.4 8.59,29.67 7.37,28.45 4.83,28.45 4.32,27.94 R6.2
RD-
  Top 0.305: U$2.3 8.62,30.47 7.11,28.96 2.79,28.96 2.29,28.45 R7.2
RESET  (via drill 0.6)
  Top 0.305: JP2.1 33.02,48.26 21.59,36.83 v20.02,36.83 | v16.26,28.19 16.26,25.65 14.2,23.6 U$2.13 14.2,21.31 13.46,20.57 12.95,20.57 12.19,19.81 12.19,12.19 11.68,11.68 7.05,11.68 6.28,10.92 R11.1 6.28,8.45 v6.6,8.13 | S2.3 S2.4 v25.4,8.38
  Bottom 0.305: 16.26,36.58 10.92,36.58 10.16,35.81 10.16,27.69 8.89,26.42 6.35,26.42 3.05,29.72 JP5.5 | 16.26,36.58 19.71,36.58 v20.02,36.83 | v6.6,8.13 25.15,8.13 v25.4,8.38 | v16.26,28.19 16.26,36.58
ROW1  (via drill 0.6)
  Top 0.305: LED4.K 58.04,41.78 57.15,42.67 53.09,42.67 51.85,41.44 LED27.C LED23.C 39.15,41.44 v39.12,41.4 39.08,41.44 LED28.C | U$2.28 33.4,28.07 v34.8,29.46
  Bottom 0.305: v34.8,29.46 32,29.46 30.48,30.99 30.48,32.77 38.61,40.89 v39.12,41.4
ROW2  (via drill 0.6)
  Top 0.305: v50.04,36.07 49.15,35.18 LED24.C | LED17.C 41.53,35.43 v42.16,36.07 | LED22.C 33.91,35.94 34.04,36.07 | U$2.29 30.64,28.87 32.51,30.73 32.51,35.56 33.02,36.07 34.04,36.07 | 34.04,36.07 v35.31,36.07
  Bottom 0.305: LED9.K 58.04,34.16 56.13,36.07 v50.04,36.07 v42.16,36.07 v35.31,36.07
ROW3  (via drill 0.6)
  Top 0.305: v49.78,27.69 49.15,27.05 LED25.C | LED18.C 41.53,27.05 v42.16,27.69 | LED21.C 33.91,26.54 34.04,26.67 | U$2.12 13.4,24.07 v14.99,25.65 | v29.72,26.67 34.04,26.67 | 34.04,26.67 34.54,26.67 v35.56,27.69
  Bottom 0.305: LED10.K 58.04,26.04 56.39,27.69 v49.78,27.69 v42.16,27.69 v35.56,27.69 | v14.99,25.65 16.76,27.43 24.64,27.43 25.4,28.19 28.19,28.19 v29.72,26.67
ROW4  (via drill 0.6)
  Top 0.305: v50.04,20.32 49.15,19.43 LED26.C | LED19.C 41.53,19.43 v42.42,20.32 | LED20.C 33.91,20.19 34.04,20.32 | U$2.26 25.09,26.47 25.91,25.65 29.97,25.65 31.75,23.88 31.75,21.84 33.27,20.32 34.04,20.32 | 34.04,20.32 v35.31,20.32
  Bottom 0.305: LED14.K 58.04,18.41 56.13,20.32 v50.04,20.32 v42.42,20.32 v35.31,20.32
SCK  (via drill 0.6)
  Top 0.305: U$2.9 9.89,25.67 v9.65,25.91
  Bottom 0.305: v9.65,25.91 3.05,25.91 1.52,27.43 1.52,32.26 2.29,33.02 JP5.3
UCAP
  Top 0.305: U$2.6 9.53,28.07 9.14,28.45 8.13,28.45 7.62,27.94 6.6,27.94 6.35,27.69 C3.1

### Text on the board
tNames: A5 | A4 | A3 | A2 | A1 | NC | NC | GND | GND | +5V | NC | RESET | POTENTIO- / METER | PWR | R1 | ROW1 | BUTTON | C2 | L1 | R3 | COL1 | COL4 | R7 | R6 | C3 | C4 | Z2 | Z1 | R10 | C1 | ROW4 | RESET | R8 | R9 | R11 | AREF | D13 | GND | D0 | D1 | D2 | D3 | D4 | D5 | D6 | D7 | NC | NC | NC | NC | NC | MHacks 6 / Hacker / Board
bNames: MHacks 6 | Hacker Board | (rev 2)